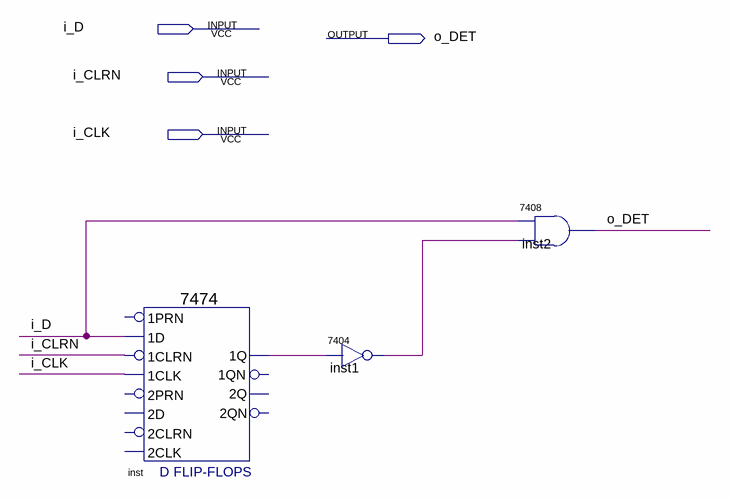
[diagram p0: schematic sheet]
// Quartus schematic posedge_detector.bdf as structural Verilog: 3 symbols, 4 pins
module posedge_detector (
  input  i_D,
  input  i_CLRN,
  input  i_CLK,
  output o_DET
);

  wire inst1_1, inst_1q;

  \7474  inst (
    .\1CLK (i_CLK), .\1D (i_D), .\1CLRN (i_CLRN), .\1Q (inst_1q));  // open: 2D, 2PRN, 1PRN, 2CLK, 2CLRN, 1QN, 2Q, 2QN
  \7404  inst1 (.\2 (inst_1q), .\1 (inst1_1));
  \7408  inst2 (.\3 (inst1_1), .\2 (i_D), .\1 (o_DET));
endmodule
